# Altium schematic sheet dcdc_sn6505_for_iso_ifaces.schdoc
size 209 x 297 mm
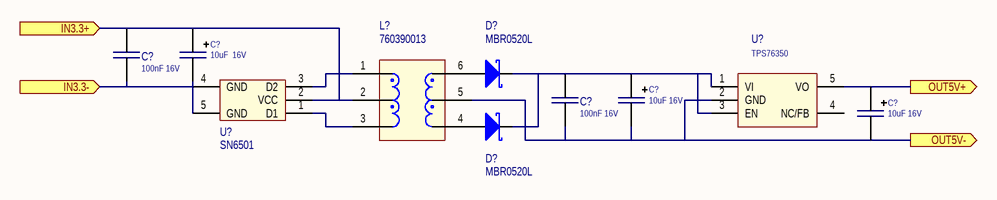
[diagram p0: dcdc_sn6505_for_iso_ifaces.schdoc]

## Parts
(Parts that share a designator on the sheet are numbered #1, #2 ... from top to bottom, then left to right.)
C?#1  100nF 16V  [C_0603]
C?#2  10uF  16V  [CPM3216]
C?#3  100nF 16V  [C_0603]
C?#4  10uF 16V  [CPM3216]
C?#5  10uF 16V  [CPM3216]
D?#1  MBR0520L  [SOD-123]
D?#2  MBR0520L  [SOD-123]
L?  760390013  [760390014]
U?#1  TPS76350  [SOT23-5]
U?#2  SN6501  [SOT23-5]

## Ports
IN3.3+ (in), IN3.3- (in), OUT5V+ (out), OUT5V- (out)

## Nets
IN3.3+: C?#1.2 C?#2.1 L?.2 U?#2.2(VCC) ; port IN3.3+
IN3.3-: C?#1.1 C?#2.2 U?#2.4(GND) U?#2.5(GND) ; port IN3.3-
OUT5V+: C?#5.1 U?#1.5(VO) ; port OUT5V+
OUT5V-: C?#3.1 C?#4.2 C?#5.2 L?.5 U?#1.2(GND) ; port OUT5V-
NetC?#3_2: C?#3.2 C?#4.1 D?#1.2(K) D?#2.2(K) U?#1.1(VI) U?#1.3(EN)
NetD?#1_1: D?#1.1(A) L?.6
NetD?#2_1: D?#2.1(A) L?.4
NetL?_1: L?.1 U?#2.3(D2)
NetL?_3: L?.3 U?#2.1(D1)

Not connected (* = marked no-connect by the designer): U?#1 4(NC/FB)

## Library data of the parts
C?#1 C?#3 = C0603: Capacitor; Value: 100nF 16V
C?#2 C?#4 C?#5 = CPM3216: Capasitor
D?#1 D?#2 = DS_SOD123: Schottky Diode
L? = L_760390014: Transformer  Push-Pull
U?#1 = TPS76350: LDO
U?#2 = SN6501: Transformer Driver for Isolated Power Supplies